# EAGLE design Led Strip 23 (EAGLE 9.2.2)
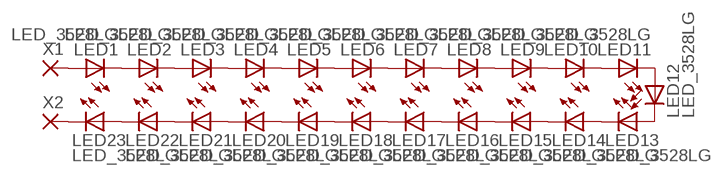
[diagram p0: schematic, sheet 1]

## Parts
LED1  LED_3528LG  [LED2835_LG]
LED2  LED_3528LG  [LED2835_LG]
LED3  LED_3528LG  [LED2835_LG]
LED4  LED_3528LG  [LED2835_LG]
LED5  LED_3528LG  [LED2835_LG]
LED6  LED_3528LG  [LED2835_LG]
LED7  LED_3528LG  [LED2835_LG]
LED8  LED_3528LG  [LED2835_LG]
LED9  LED_3528LG  [LED2835_LG]
LED10  LED_3528LG  [LED2835_LG]
LED11  LED_3528LG  [LED2835_LG]
LED12  LED_3528LG  [LED2835_LG]
LED13  LED_3528LG  [LED2835_LG]
LED14  LED_3528LG  [LED2835_LG]
LED15  LED_3528LG  [LED2835_LG]
LED16  LED_3528LG  [LED2835_LG]
LED17  LED_3528LG  [LED2835_LG]
LED18  LED_3528LG  [LED2835_LG]
LED19  LED_3528LG  [LED2835_LG]
LED20  LED_3528LG  [LED2835_LG]
LED21  LED_3528LG  [LED2835_LG]
LED22  LED_3528LG  [LED2835_LG]
LED23  LED_3528LG  [LED2835_LG]
X1  WIREPAD-SMD2  [PAD-1.27X2.54]
X2  WIREPAD-SMD2  [PAD-1.27X2.54]

## Nets
N$1: LED1.A X1.P$1(P)
N$2: LED1.C LED2.A
N$3: LED2.C LED3.A
N$4: LED3.C LED4.A
N$5: LED4.C LED5.A
N$6: LED5.C LED6.A
N$7: LED6.C LED7.A
N$8: LED7.C LED8.A
N$9: LED8.C LED9.A
N$10: LED9.C LED10.A
N$11: LED10.C LED11.A
N$12: LED11.C LED12.A
N$13: LED12.C LED13.A
N$14: LED14.C LED15.A
N$15: LED15.C LED16.A
N$16: LED16.C LED17.A
N$17: LED17.C LED18.A
N$18: LED18.C LED19.A
N$19: LED19.C LED20.A
N$20: LED20.C LED21.A
N$21: LED21.C LED22.A
N$22: LED22.C LED23.A
N$23: LED23.C X2.P$1(P)
N$24: LED13.C LED14.A

## Library data of the parts
LED1-LED23 = Flamberm:LED_
X1 X2 = Flamberm:WIREPAD-SMD2: SMD PAD

## Board
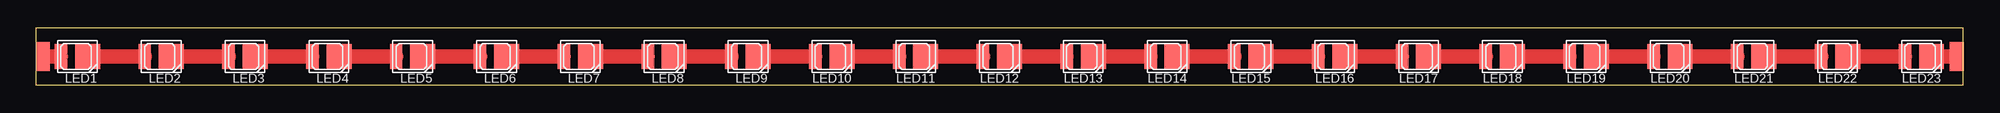
[diagram p1: board, top side]

Size 170 x 5 mm. Coordinates in mm from the lower left corner, seen from the top.
Outline: 0,0 170,0 170,5 0,5 0,0
Copper layers (1*16): Top 0.035mm / dielectric 1mm / Bottom 0.035mm
Design rules "default *": minimum track width 6mil, minimum drill 0.35mm, track to track 6mil, track to pad 6mil, pad to pad 6mil, via to via 6mil, smd to smd 6mil, copper to edge 40mil, drill to drill 6mil, minimum pad ring 10mil, minimum via ring 8mil, stop-mask expansion 4mil, vias tented up to drill 0mil, thermal gap 10mil

### Footprints (pad centres in the part's own frame; a part is rotated, then mirrored left to right if it is on the bottom)
LED2835_LG = smd 1.1 x 2.2: A 1.46,0 | smd 2.2 x 2.2: C -0.889,0
PAD-1.27X2.54 = smd 2.54 x 1.27: P$1 0,0

### Placement (x,y rotation side)
LED1  3.69,2.5 180 top
LED2  11.09,2.5 180 top
LED3  18.48,2.5 180 top
LED4  25.87,2.5 180 top
LED5  33.26,2.5 180 top
LED6  40.65,2.5 180 top
LED7  48.04,2.5 180 top
LED8  55.43,2.5 180 top
LED9  62.83,2.5 180 top
LED10  70.22,2.5 180 top
LED11  77.61,2.5 180 top
LED12  85,2.5 180 top
LED13  92.39,2.5 180 top
LED14  99.78,2.5 180 top
LED15  107.17,2.5 180 top
LED16  114.56,2.5 180 top
LED17  121.96,2.5 180 top
LED18  129.35,2.5 180 top
LED19  136.74,2.5 180 top
LED20  144.13,2.5 180 top
LED21  151.52,2.5 180 top
LED22  158.91,2.5 180 top
LED23  166.3,2.5 180 top
X1  0.64,2.5 90 top
X2  169.42,2.5 90 top

### Tracks (layer width: path | path; a pad name or v marks a point on that pad's centre or on a via)
N$1
  Top 1.27: X1.P$1 LED1.A
N$2
  Top 1.27: LED1.C LED2.A
N$3
  Top 1.27: LED2.C LED3.A
N$4
  Top 1.27: LED3.C LED4.A
N$5
  Top 1.27: LED4.C LED5.A
N$6
  Top 1.27: LED5.C LED6.A
N$7
  Top 1.27: LED6.C LED7.A
N$8
  Top 1.27: LED7.C LED8.A
N$9
  Top 1.27: LED8.C LED9.A
N$10
  Top 1.27: LED9.C LED10.A
N$11
  Top 1.27: LED10.C LED11.A
N$12
  Top 1.27: LED11.C LED12.A
N$13
  Top 1.27: LED12.C LED13.A
N$14
  Top 1.27: LED14.C LED15.A
N$15
  Top 1.27: LED15.C LED16.A
N$16
  Top 1.27: LED16.C LED17.A
N$17
  Top 1.27: LED17.C LED18.A
N$18
  Top 1.27: LED18.C LED19.A
N$19
  Top 1.27: LED19.C LED20.A
N$20
  Top 1.27: LED20.C LED21.A
N$21
  Top 1.27: LED21.C LED22.A
N$22
  Top 1.27: LED22.C LED23.A
N$23
  Top 1.27: X2.P$1 LED23.C
N$24
  Top 1.27: LED13.C LED14.A